# Altium project PCB_Project.PrjPcb
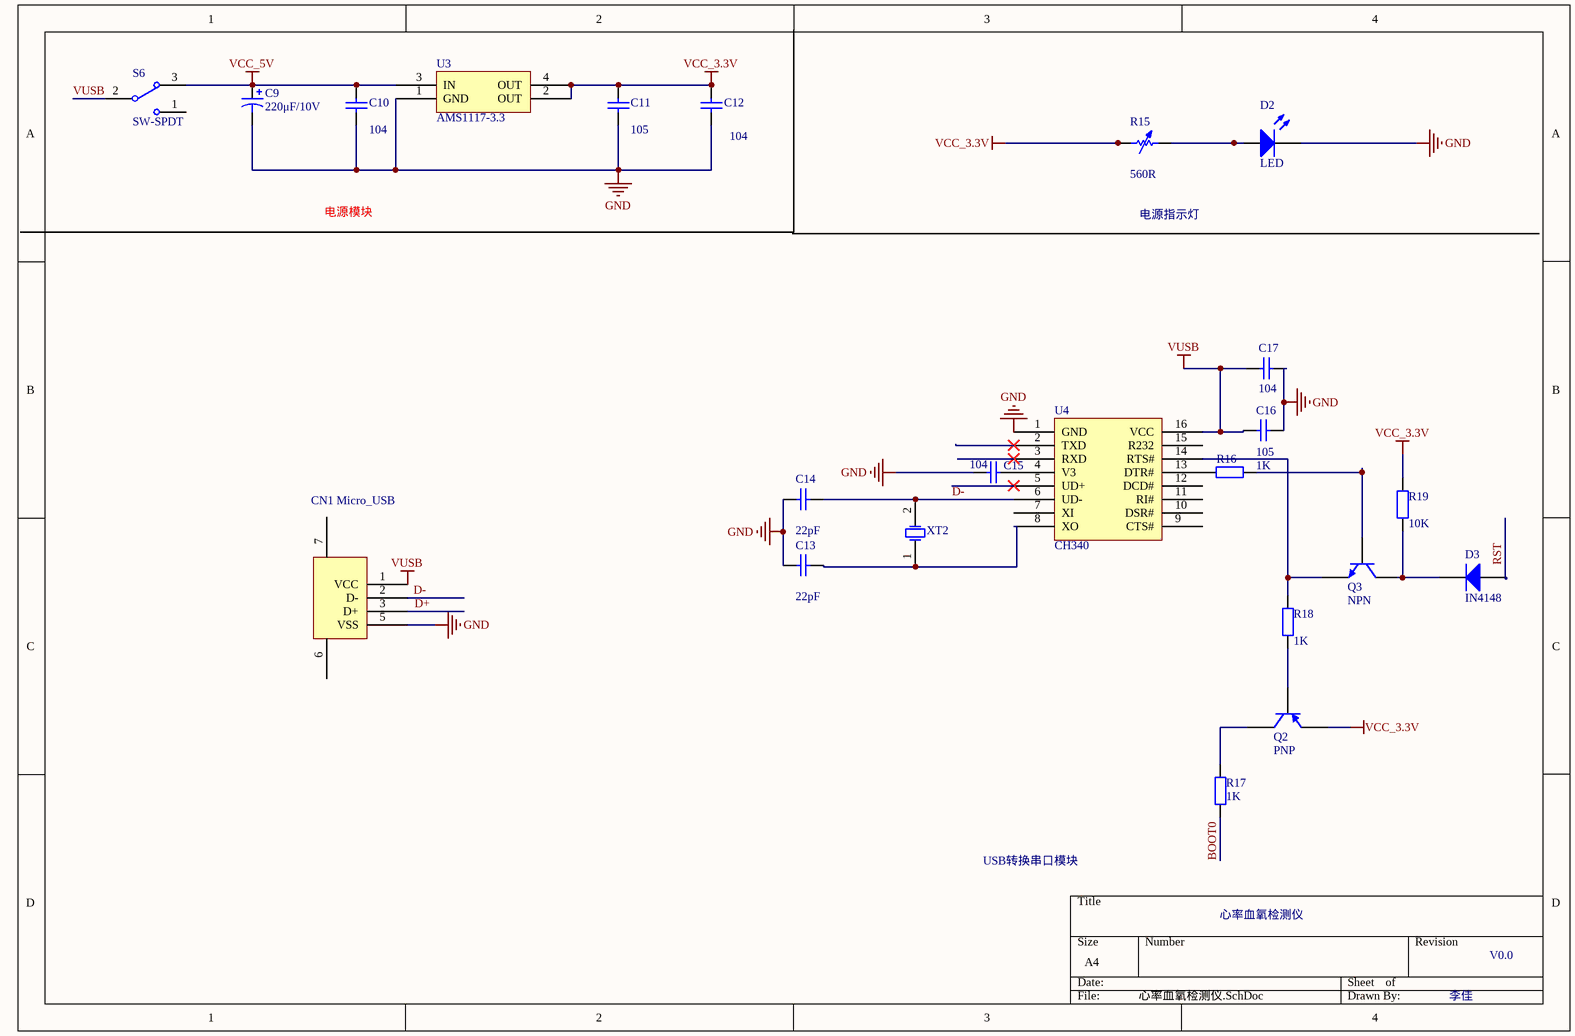
[diagram p0: 心率血氧检测仪.SchDoc]
3 sheets, 57 parts. Net scope: global (net labels, ports and power ports of the same name join across sheets).
Board file: 心率血氧.PcbDoc
Sheets:
  心率血氧检测仪.SchDoc
  心率血氧检测仪1.SchDoc
  心率血氧检测仪2.SchDoc

## Sheet 心率血氧检测仪.SchDoc: 心率血氧检测仪
size A4; DrawnBy: 李佳; Revision: V0.0

### Parts
*2  CN1 Micro_USB  [SOT-223]
C9  value 220μF/10V  [CAP6.5X6.5]  (hidden comment: Cap Pol1)
C10  value 104  [0805C]  (hidden comment: Cap)
C11  value 105  [0805C]  (hidden comment: Cap)
C12  value 104  [0805C]  (hidden comment: Cap)
C13  value 22pF  [0805C]  (hidden comment: Cap)
C14  value 22pF  [0805C]  (hidden comment: Cap)
C15  value 104  [0805C]  (hidden comment: Cap)
C16  value 105  [0805C]
C17  value 104  [0805C]  (hidden comment: Cap)
D2  LED  [LED_0805]
D3  IN4148  [DO-213AA]
Q2  PNP  [SOT-23]
Q3  NPN  [SOT-23]
R15  value 560R  [0805]  (hidden comment: Res Adj1)
R16  value 1K  [0805]  (hidden comment: Res2)
R17  value 1K  [0805]  (hidden comment: Res2)
R18  value 1K  [0805]  (hidden comment: Res2)
R19  value 10K  [0805]  (hidden comment: Res2)
S6  SW-SPDT  [BTN8*8]
U3  AMS1117-3.3  [SOT-223]
U4  CH340  [SOP16]
XT2  XTAL  [HC-49S]  (value not drawn)

### Nets
GND: *2.5(VSS) C9.2 C10.2 C11.2 C12.2 C13.1 C14.1 C15.1 C16.2 C17.2 D2.2(K) U3.1(GND) U4.1(GND)
VCC_3.3V: C11.1 C12.1 Q2.1(E) R15.1 R19.2 U3.2(OUT) U3.4(OUT)
VCC_5V: C9.1 C10.1 S6.3 U3.3(IN)
VUSB: *2.1(VCC) C16.1 C17.1 S6.2 U4.16(VCC)
BOOT0: R17.1
D+: *2.3(D+)
D-: *2.2(D-) C14.2 U4.6(UD-) XT2.2(OSC2)
RST: D3.1(A)
NetC13_2: C13.2 U4.8(XO) XT2.1(OSC1)
NetC15_2: C15.2 U4.4(V3)
NetD2_1: D2.1(A) R15.2
NetD3_2: D3.2(K) Q3.3(C) R19.1
NetQ2_2: Q2.2(B) R18.1
NetQ2_3: Q2.3(C) R17.2
NetQ3_1: Q3.1(E) R18.2 U4.14(RTS#)
NetQ3_2: Q3.2(B) R16.2
NetR16_1: R16.1 U4.13(DTR#)

Not connected (* = marked no-connect by the designer): *2 6(7) 7(6); S6 1; U4 2(TXD)* 3(RXD)* 5(UD+)* 7(XI) 9(CTS#) 10(DSR#) 11(RI#) 12(DCD#) 15(R232)

### Notes on the sheet
- 电源模块
- 电源指示灯
- USB转换串口模块

### Library data of the parts
C9 = Cap Pol1: Polarized Capacitor (Radial); Published: 8-Jun-2000; LatestRevisionDate: 17-Jul-2002; LatestRevisionNote: Re-released for DXP Platform.; PackageReference: RB7.6-15; Publisher: Altium Limited; PackageDescription: Polarized Capacitor (Radial); 2 Leads
C10-C17 = Cap: Capacitor; Published: 8-Jun-2000; LatestRevisionDate: 17-Jul-2002; LatestRevisionNote: Re-released for DXP Platform.; PackageReference: RAD-0.3; Publisher: Altium Limited; PackageDescription: Radial Cap, Thru-Hole; 2 Leads; 0.3 in Pin Spacing
D2 = LED0: Typical INFRARED GaAs LED; Published: 8-Jun-2000; LatestRevisionDate: 08-Jul-2005; LatestRevisionNote: Mech Layer 1 removed.; PackageReference: LED-0; Publisher: Altium Limited; PackageDescription: LED; 2 Leads
D3 = Diode: Default Diode; Published: 8-Jun-2000; LatestRevisionDate: 17-Jul-2002; LatestRevisionNote: Re-released for DXP Platform.; PackageVersion: Sep-1996; PackageReference: SMC; Publisher: Altium Limited; PackageDescription: DO-214-AB/SMC; 2 C-Bend Leads; Body 7.9 x 5.9 mm, inc. leads (LxW); Code_JEDEC: DO-214-AB
Q2 = 2N3906: PNP General Purpose Amplifier; Published: 8-Jun-2000; LatestRevisionDate: 15-Jan-2003; LatestRevisionNote: PCB Footprint 'BCY-W3/D4.7' replaced; DatasheetVersion: 1997; PackageVersion: Sep-1998; PackageReference: TO-92A; Publisher: Altium Limited; PackageDescription: TO, Flat Index; 3 In-Line, Axial Leads; Body Dia. 4.5mm; Leads 0.51 x 0.48 mm (max); ComponentLink1Description: Manufacturer Link; ComponentLink1URL: http://www.fairchildsemi.com/; ComponentLink2Description: Datasheet; ComponentLink2URL: http://www.fairchildsemi.com/ds/2N%2F2N3906.pdf
Q3 = 2N3904: NPN General Purpose Amplifier; Published: 8-Jun-2000; LatestRevisionDate: 15-Jan-2003; LatestRevisionNote: PCB Footprint 'BCY-W3/D4.7' replaced; DatasheetVersion: 1997; PackageVersion: Sep-1998; PackageReference: TO-92A; Publisher: Altium Limited; PackageDescription: TO, Flat Index; 3 In-Line, Axial Leads; Body Dia. 4.5mm; Leads 0.51 x 0.48 mm (max); ComponentLink1Description: Manufacturer Link; ComponentLink1URL: http://www.fairchildsemi.com/; ComponentLink2Description: Datasheet; ComponentLink2URL: http://www.fairchildsemi.com/ds/2N%2F2N3904.pdf
R15 = Res Adj1: Variable Resistor; Set Position: 0.5; Published: 8-Jun-2000; LatestRevisionDate: 17-Jul-2002; LatestRevisionNote: Re-released for DXP Platform.; PackageReference: AXIAL-0.7; Publisher: Altium Limited; PackageDescription: Axial Device, Thru-Hole; 2 Leads; 0.7 in Pin Spacing
R16-R19 = Res2: Resistor; Published: 8-Jun-2000; LatestRevisionDate: 17-Jul-2002; LatestRevisionNote: Re-released for DXP Platform.; PackageReference: AXIAL-0.4; Publisher: Altium Limited; PackageDescription: Axial Device, Thru-Hole; 2 Leads; 0.4 in Pin Spacing
S6 = SW-SPDT: SPDT Subminiature Toggle Switch, Right Angle Mounting, Vertical Actuation; Published: 24-Mar-1999; LatestRevisionDate: 17-Dec-2003; LatestRevisionNote: Schematic revised, PCB Footprint replaced.; DatasheetVersion: 05-Dec-2000; PackageReference: TL36WW15050; Publisher: Altium Limited; PackageDescription: Switch; 4 Leads; ComponentLink1Description: Manufacturer Link; ComponentLink1URL: http://www.apem.com
XT2 = XTAL: Crystal Oscillator; Value: 12MHZ; Published: 8-Jun-2000; LatestRevisionDate: 17-Jul-2002; LatestRevisionNote: Re-released for DXP Platform.; PackageReference: R38; Publisher: Altium Limited; PackageDescription: Crystal, Thru-Hole; 2 Leads; Body 3.1 x 8.2 mm (Dia.xH)

## Sheet 心率血氧检测仪1.SchDoc
size A4
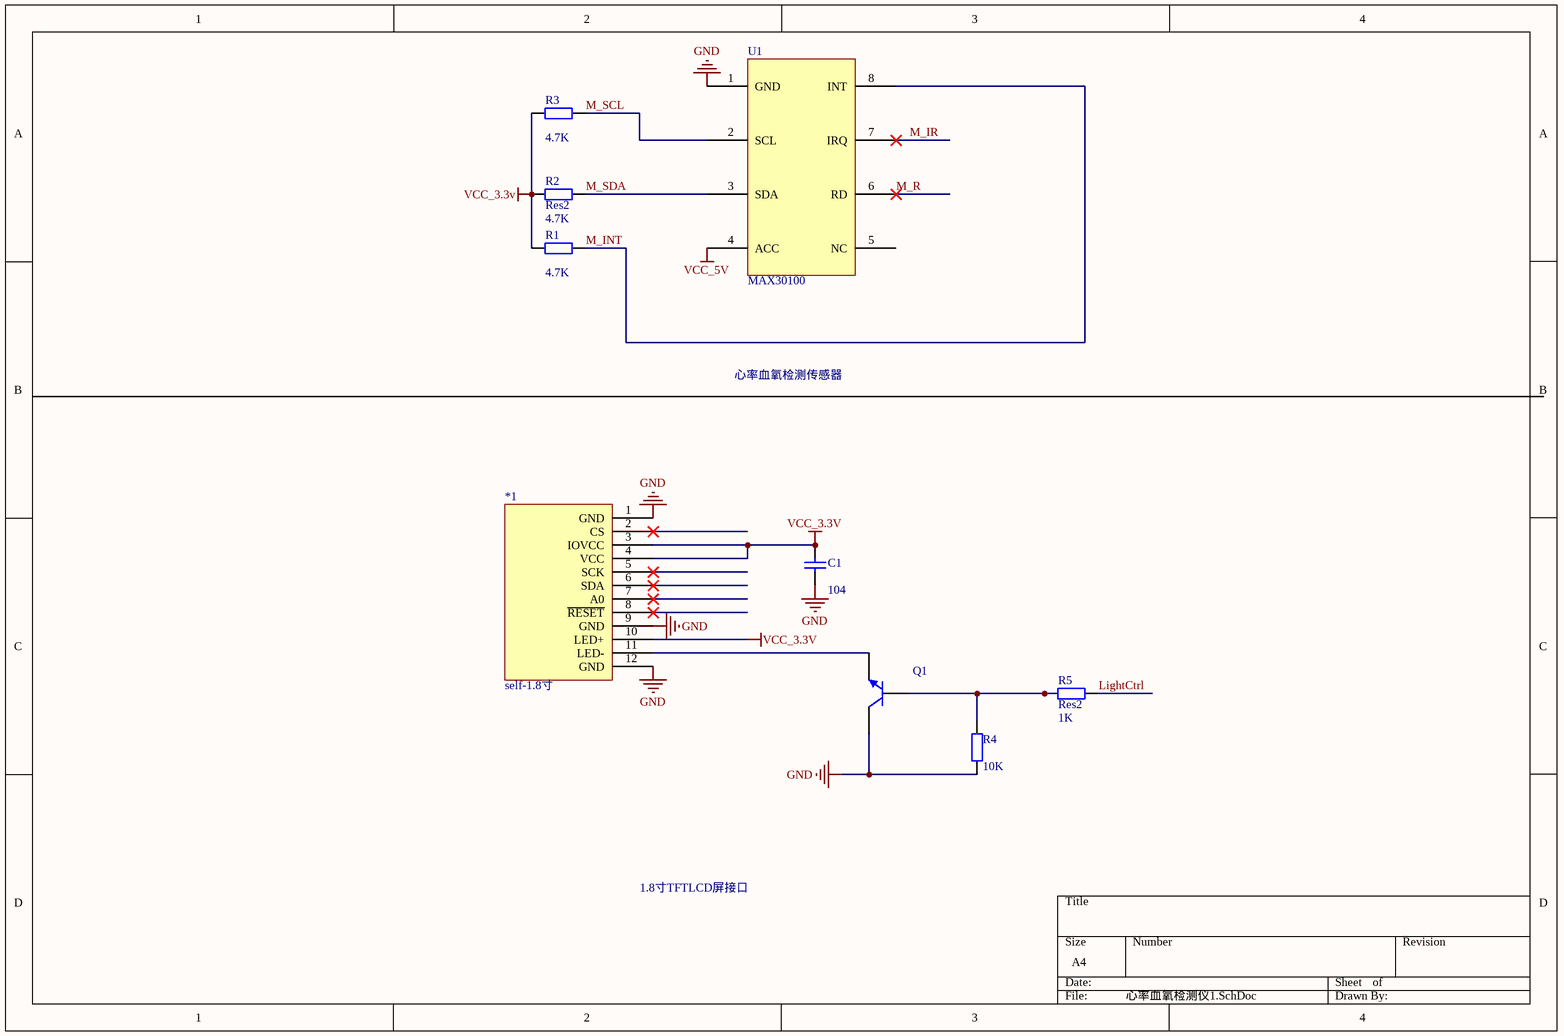
[diagram p1: 心率血氧检测仪1.SchDoc]

### Parts
*1  self-1.8寸  [self-1.8 - 1]
C1  value 104  [0805C]  (hidden comment: Cap)
Q1  2N3904  [三极管SOT23]  (value not drawn)
R1  value 4.7K  [0805]  (hidden comment: Res2)
R2  Res2  value 4.7K  [0805]
R3  value 4.7K  [0805]  (hidden comment: Res2)
R4  value 10K  [0805]  (hidden comment: Res2)
R5  Res2  value 1K  [0805]
U1  MAX30100  [MAX30100模块]

### Nets
GND: *1.1(GND) *1.9(GND) *1.12(GND) C1.1 Q1.3(C) R4.1 U1.1(GND)
VCC_3.3V: *1.3(IOVCC) *1.4(VCC) *1.10(LED+) C1.2 R1.1 R2.1 R3.1
VCC_5V: U1.4(ACC)
LightCtrl: R5.2
M_INT: R1.2 U1.8(INT)
M_IR: U1.7(IRQ)
M_R: U1.6(RD)
M_SCL: R3.2 U1.2(SCL)
M_SDA: R2.2 U1.3(SDA)
Net*1_11: *1.11(LED-) Q1.1(E)
NetQ1_2: Q1.2(B) R4.2 R5.1

Not connected (* = marked no-connect by the designer): *1 2(CS)* 5(SCK)* 6(SDA)* 7(A0)* 8(~{RESET})*; U1 5(NC)

### Notes on the sheet
- 心率血氧检测传感器
- 1.8寸TFTLCD屏接口

### Library data of the parts
C1 = Cap: Capacitor; Published: 8-Jun-2000; LatestRevisionDate: 17-Jul-2002; LatestRevisionNote: Re-released for DXP Platform.; PackageReference: RAD-0.3; Publisher: Altium Limited; PackageDescription: Radial Cap, Thru-Hole; 2 Leads; 0.3 in Pin Spacing
Q1 = 2N3904: NPN General Purpose Amplifier; Published: 8-Jun-2000; LatestRevisionDate: 15-Jan-2003; LatestRevisionNote: PCB Footprint 'BCY-W3/D4.7' replaced; DatasheetVersion: 1997; PackageVersion: Sep-1998; PackageReference: TO-92A; Publisher: Altium Limited; PackageDescription: TO, Flat Index; 3 In-Line, Axial Leads; Body Dia. 4.5mm; Leads 0.51 x 0.48 mm (max); ComponentLink1Description: Manufacturer Link; ComponentLink1URL: http://www.fairchildsemi.com/; ComponentLink2Description: Datasheet; ComponentLink2URL: http://www.fairchildsemi.com/ds/2N%2F2N3904.pdf
R1-R5 = Res2: Resistor; Published: 8-Jun-2000; LatestRevisionDate: 17-Jul-2002; LatestRevisionNote: Re-released for DXP Platform.; PackageReference: AXIAL-0.4; Publisher: Altium Limited; PackageDescription: Axial Device, Thru-Hole; 2 Leads; 0.4 in Pin Spacing

## Sheet 心率血氧检测仪2.SchDoc
size A4
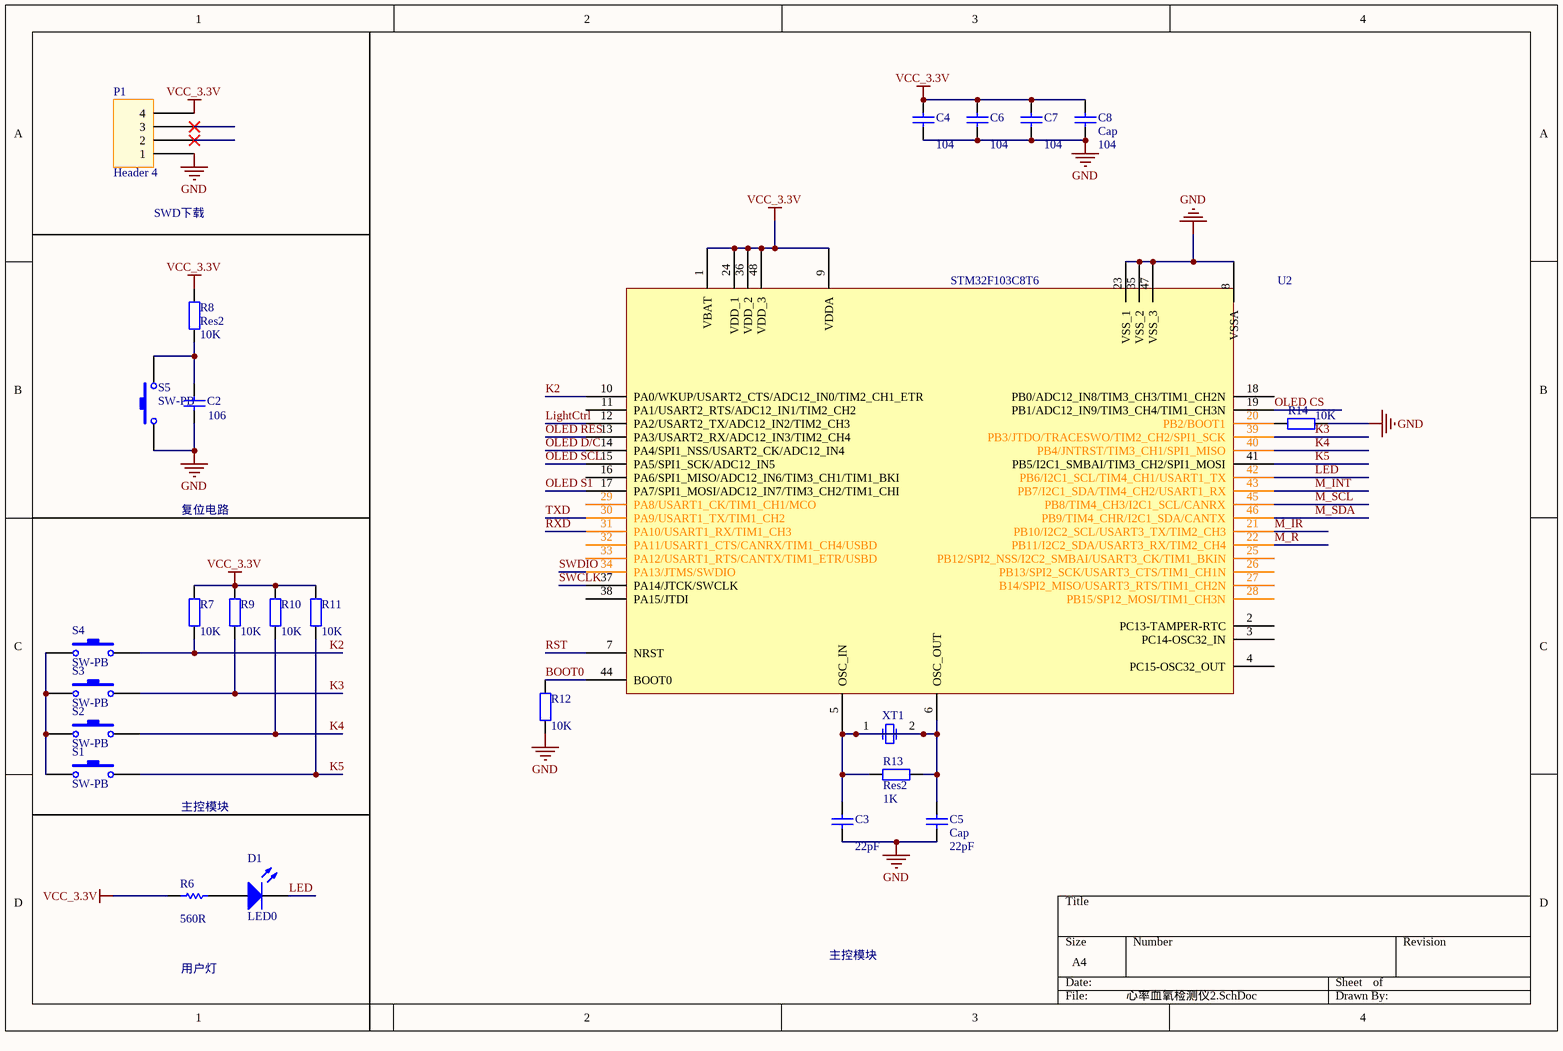
[diagram p2: 心率血氧检测仪2.SchDoc]

### Parts
C2  value 106  [0805C]  (hidden comment: Cap)
C3  value 22pF  [0805C]  (hidden comment: Cap)
C4  value 104  [0805C]  (hidden comment: Cap)
C5  Cap  value 22pF  [0805C]
C6  value 104  [0805C]  (hidden comment: Cap)
C7  value 104  [0805C]  (hidden comment: Cap)
C8  Cap  value 104  [0805C]
D1  LED0  [LED_0805]
P1  Header 4  [HDR1X4]
R6  value 560R  [电阻0805]  (hidden comment: Res Semi)
R7  value 10K  [0805]  (hidden comment: Res2)
R8  Res2  value 10K  [0805]
R9  value 10K  [0805]  (hidden comment: Res2)
R10  value 10K  [0805]  (hidden comment: Res2)
R11  value 10K  [0805]  (hidden comment: Res2)
R12  value 10K  [0805]  (hidden comment: Res2)
R13  Res2  value 1K  [0805]
R14  value 10K  [0805]  (hidden comment: Res2)
S1  SW-PB  [2脚按键]
S2  SW-PB  [2脚按键]
S3  SW-PB  [2脚按键]
S4  SW-PB  [2脚按键]
S5  SW-PB  [2脚按键]
U2  STM32F103C8T6  [LQFP48]
XT1  XTAL  [HC-49S]  (value not drawn)

### Nets
GND: C2.1 C3.1 C4.1 C5.1 C6.1 C7.1 C8.1 P1.1 R12.1 R14.2 S5.1 U2.8(VSSA) U2.23(VSS_1) U2.35(VSS_2) U2.47(VSS_3)
VCC_3.3V: C4.2 C6.2 C7.2 C8.2 P1.4 R6.1 R7.2 R8.2 R9.2 R10.2 R11.2 U2.1(VBAT) U2.9(VDDA) U2.24(VDD_1) U2.36(VDD_2) U2.48(VDD_3)
BOOT0: R12.2 U2.44(BOOT0)
K2: R7.1 S4.2 U2.10(PA0/WKUP/USART2_CTS/ADC12_IN0/TIM2_CH1_ETR)
K3: R9.1 S3.2 U2.39(PB3/JTDO/TRACESWO/TIM2_CH2/SPI1_SCK)
K4: R10.1 S2.2 U2.40(PB4/JNTRST/TIM3_CH1/SPI1_MISO)
K5: R11.1 S1.2 U2.41(PB5/I2C1_SMBAI/TIM3_CH2/SPI1_MOSI)
LED: D1.2(K) U2.42(PB6/I2C1_SCL/TIM4_CH1/USART1_TX)
LightCtrl: U2.12(PA2/USART2_TX/ADC12_IN2/TIM2_CH3)
M_INT: U2.43(PB7/I2C1_SDA/TIM4_CH2/USART1_RX)
M_IR: U2.21(PB10/I2C2_SCL/USART3_TX/TIM2_CH3)
M_R: U2.22(PB11/I2C2_SDA/USART3_RX/TIM2_CH4)
M_SCL: U2.45(PB8/TIM4_CH3/I2C1_SCL/CANRX)
M_SDA: U2.46(PB9/TIM4_CHR/I2C1_SDA/CANTX)
OLED CS: U2.19(PB1/ADC12_IN9/TIM3_CH4/TIM1_CH3N)
OLED D/C: U2.14(PA4/SPI1_NSS/USART2_CK/ADC12_IN4)
OLED RES: U2.13(PA3/USART2_RX/ADC12_IN3/TIM2_CH4)
OLED S1: U2.17(PA7/SPI1_MOSI/ADC12_IN7/TIM3_CH2/TIM1_CHI)
OLED SCL: U2.15(PA5/SPI1_SCK/ADC12_IN5)
RST: U2.7(NRST)
RXD: U2.31(PA10/USART1_RX/TIM1_CH3)
SWCLK: U2.37(PA14/JTCK/SWCLK)
SWDIO: U2.34(PA13/JTMS/SWDIO)
TXD: U2.30(PA9/USART1_TX/TIM1_CH2)
NetC2_2: C2.2 R8.1 S5.2
NetC3_2: C3.2 C5.2 R13.1 R13.2 U2.5(OSC_IN) U2.6(OSC_OUT) XT1.1(OSC1) XT1.2(OSC2)
NetD1_1: D1.1(A) R6.2
NetR14_1: R14.1 U2.20(PB2/BOOT1)
NetS1_1: S1.1 S2.1 S3.1 S4.1

Not connected (* = marked no-connect by the designer): P1 2* 3*; U2 2(PC13-TAMPER-RTC) 3(PC14-OSC32_IN) 4(PC15-OSC32_OUT) 11(PA1/USART2_RTS/ADC12_IN1/TIM2_CH2) 16(PA6/SPI1_MISO/ADC12_IN6/TIM3_CH1/TIM1_BKI) 18(PB0/ADC12_IN8/TIM3_CH3/TIM1_CH2N) 25(PB12/SPI2_NSS/I2C2_SMBAI/USART3_CK/TIM1_BKIN) 26(PB13/SPI2_SCK/USART3_CTS/TIM1_CH1N) 27(B14/SPI2_MISO/USART3_RTS/TIM1_CH2N) 28(PB15/SP12_MOSI/TIM1_CH3N) 29(PA8/USART1_CK/TIM1_CH1/MCO) 32(PA11/USART1_CTS/CANRX/TIM1_CH4/USBD) 33(PA12/USART1_RTS/CANTX/TIM1_ETR/USBD) 38(PA15/JTDI)

### Notes on the sheet
- SWD下载
- 复位电路
- 主控模块
- 用户灯

### Library data of the parts
C2-C8 = Cap: Capacitor; Published: 8-Jun-2000; LatestRevisionDate: 17-Jul-2002; LatestRevisionNote: Re-released for DXP Platform.; PackageReference: RAD-0.3; Publisher: Altium Limited; PackageDescription: Radial Cap, Thru-Hole; 2 Leads; 0.3 in Pin Spacing
D1 = LED0: Typical INFRARED GaAs LED; Published: 8-Jun-2000; LatestRevisionDate: 08-Jul-2005; LatestRevisionNote: Mech Layer 1 removed.; PackageReference: LED-0; Publisher: Altium Limited; PackageDescription: LED; 2 Leads
R6 = Res Semi: Semiconductor Resistor; Published: 8-Jun-2000; LatestRevisionDate: 17-Jul-2002; LatestRevisionNote: Re-released for DXP Platform.; PackageReference: AXIAL-0.5; Publisher: Altium Limited; PackageDescription: Axial Device, Thru-Hole; 2 Leads; 0.5 in Pin Spacing
R7-R14 = Res2: Resistor; Published: 8-Jun-2000; LatestRevisionDate: 17-Jul-2002; LatestRevisionNote: Re-released for DXP Platform.; PackageReference: AXIAL-0.4; Publisher: Altium Limited; PackageDescription: Axial Device, Thru-Hole; 2 Leads; 0.4 in Pin Spacing
S1-S5 = SW-PB: Switch; Published: 24-Mar-1999; LatestRevisionDate: 17-Jul-2002; LatestRevisionNote: Re-released for DXP Platform.; PackageReference: SPST-2; Publisher: Altium Limited; PackageDescription: Switch; 2 Leads
XT1 = XTAL: Crystal Oscillator; Published: 8-Jun-2000; LatestRevisionDate: 17-Jul-2002; LatestRevisionNote: Re-released for DXP Platform.; PackageReference: R38; Publisher: Altium Limited; PackageDescription: Crystal, Thru-Hole; 2 Leads; Body 3.1 x 8.2 mm (Dia.xH)

## Nets that join several sheets
GND: 心率血氧检测仪 (13 pins), 心率血氧检测仪1 (7 pins), 心率血氧检测仪2 (15 pins)
VCC_3.3V: 心率血氧检测仪 (7 pins), 心率血氧检测仪1 (7 pins), 心率血氧检测仪2 (16 pins)
VCC_5V: 心率血氧检测仪 (C9.1 C10.1 S6.3 U3.3), 心率血氧检测仪1 (U1.4)
BOOT0: 心率血氧检测仪 (R17.1), 心率血氧检测仪2 (R12.2 U2.44)
LightCtrl: 心率血氧检测仪1 (R5.2), 心率血氧检测仪2 (U2.12)
M_INT: 心率血氧检测仪1 (R1.2 U1.8), 心率血氧检测仪2 (U2.43)
M_IR: 心率血氧检测仪1 (U1.7), 心率血氧检测仪2 (U2.21)
M_R: 心率血氧检测仪1 (U1.6), 心率血氧检测仪2 (U2.22)
M_SCL: 心率血氧检测仪1 (R3.2 U1.2), 心率血氧检测仪2 (U2.45)
M_SDA: 心率血氧检测仪1 (R2.2 U1.3), 心率血氧检测仪2 (U2.46)
RST: 心率血氧检测仪 (D3.1), 心率血氧检测仪2 (U2.7)